# Altium schematic sheet Digital Isolation.SchDoc
size A4
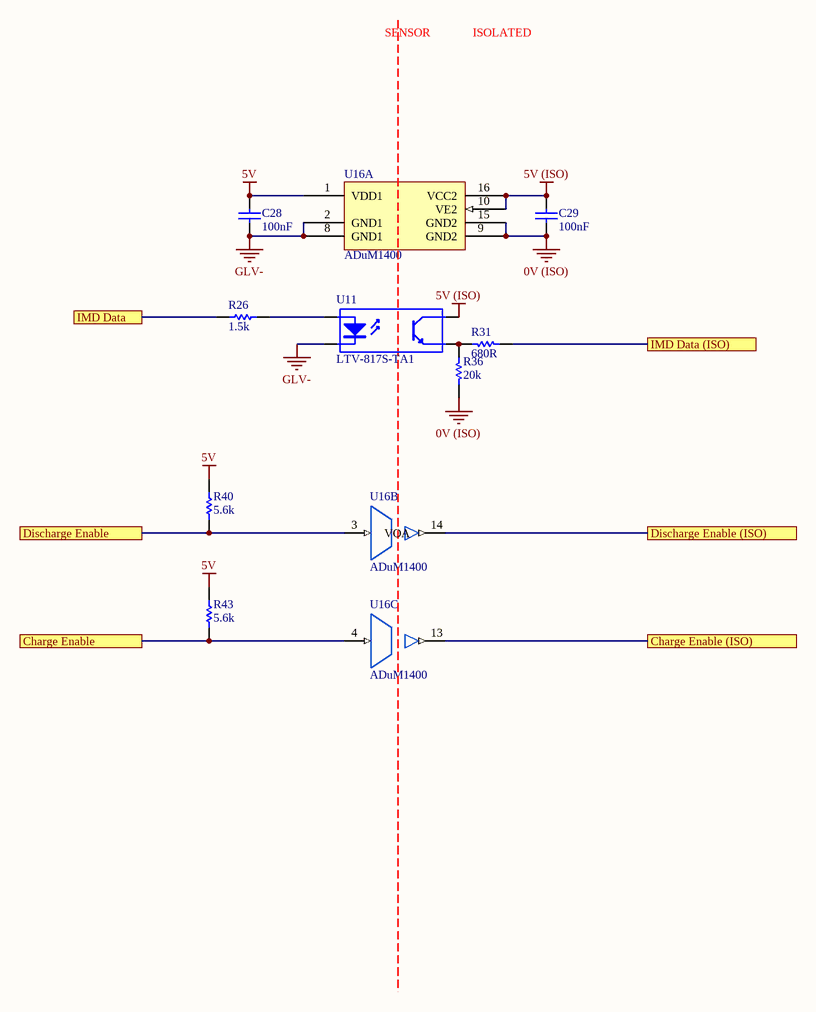
[diagram p0: Digital Isolation.SchDoc]

## Parts
C28  100nF  [0805]
C29  100nF  [0805]
R26  1.5k  [0805]
R31  680R  [0805]
R36  20k  [0805]
R40  5.6k  [0805]
R43  5.6k  [0805]
U11  LTV-817S-TA1  [ON 4-SMD]
U16  ADuM1400  [AD 16-SOIC]  (parts A,B,C of 5)

## Ports
Charge Enable, Charge Enable (ISO), Discharge Enable, Discharge Enable (ISO), IMD Data, IMD Data (ISO)

## Nets
0V (ISO): C29.1 R36.1 U16.9(GND2) U16.15(GND2)
5V: C28.2 R40.2 R43.2 U16.1(VDD1)
5V (ISO): C29.2 U11.4(C) U16.10(VE2) U16.16(VCC2)
GLV-: C28.1 U11.2(K) U16.2(GND1) U16.8(GND1)
Charge Enable: R43.1 U16.4(VIB) ; port Charge Enable
Charge Enable (ISO): U16.13(VOB) ; port Charge Enable (ISO)
Discharge Enable: R40.1 U16.3(VIA) ; port Discharge Enable
Discharge Enable (ISO): U16.14(VOA) ; port Discharge Enable (ISO)
IMD Data: R26.1 ; port IMD Data
IMD Data (ISO): R31.1 ; port IMD Data (ISO)
NetR26_2: R26.2 U11.1(A)
NetR31_2: R31.2 R36.2 U11.3(E)

## Notes on the sheet
- SENSOR
- ISOLATED

## Library data of the parts
C28 C29 = GCM21BR71E104KA37L: Manufacturer: muRata; Tolerance: 10%; Material: X7R; Rated Voltage: 25V; Part Number: GCM21BR71E104KA37L; Value: 100nF
R26 = RC0805FR071K5L: Manufacturer: YAGEO; Tolerance: 0.01; Rated Voltage: 0.125W; Part Number: RC0805FR071K5L; Value: 1.5k; Material: FR-07
R31 = RC0805FR07680RL: Manufacturer: YAGEO; Tolerance: 0.01; Rated Voltage: 0.125W; Part Number: RC0805FR07680RL; Value: 680R; Material: FR-07
R36 = RC0805FR0720KL: Manufacturer: YAGEO; Tolerance: 0.01; Rated Voltage: 0.125W; Part Number: RC0805FR0720KL; Value: 20k; Material: FR-07
R40 R43 = RC0805FR075K6L: Manufacturer: YAGEO; Tolerance: 0.01; Rated Voltage: 0.125W; Part Number: RC0805FR075K6L; Value: 5.6k; Material: FR-07
U11 = LTV-817S-TA1: 35V 50ma Optocoupler (VF=1.2V); Manufacturer: Lite-On Inc; Part Number: LTV-817S-TA1; Digikey Part Number: 160-1893-2-ND; Digikey Link: https://www.digikey.com/product-detail/en/lite-on-inc/LTV-817S-TA1/160-1893-2-ND/388451
U16 = ADuM1400: General Purpose Digital Isolator 2500Vrms 4 Channel 1Mbps 25kV/µs CMTI 16-SOIC (0.295", 7.50mm Width); Manufacturer: Analog Devices; Part Number: ADuM1400; Digikey Part Number: ADUM1400WSRWZ-ND; Digikey Link: https://www.digikey.com/product-detail/en/analog-devices-inc/ADUM1400WSRWZ/ADUM1400WSRWZ-ND/1873713